# Altium project TOUCH.PrjPcb
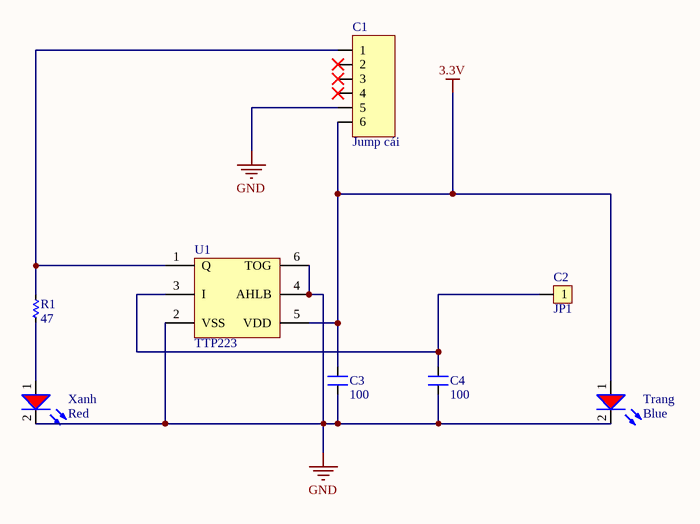
[diagram p0: TOUCH1.SchDoc]
4 sheets, 8 parts. Net scope: global (net labels, ports and power ports of the same name join across sheets).
Board file: PCB1.PcbDoc
Sheets:
  POWER.SchDoc
  TOUCH1.SchDoc
  TOUCH2.SchDoc
  TOUCH3.SchDoc

## Sheet POWER.SchDoc
size A4

## Sheet TOUCH1.SchDoc
size A4

### Parts
C1  Jump cái  [JP6-C1T]
C2  JP1  [JP1-D1T]
C3  100  [SM-0805]
C4  100  [SM-0805]
R1  47  [RES-SMD-0805]
Trang  value Blue  [LED-RED-0805]  (hidden comment: LED-Red)
U1  TTP223  [SOT23-6]
Xanh  value Red  [LED-RED-0805]  (hidden comment: LED-Red)

### Nets
3.3V: C1.6 C3.1 Trang.1(A) U1.5(VDD)
GND: C1.5 C3.2 C4.2 Trang.2(K) U1.2(VSS) U1.4(AHLB) U1.6(TOG) Xanh.2(K)
NetC1_1: C1.1 R1.1 U1.1(Q)
NetC2_1: C2.1 C4.1 U1.3(I)
NetR1_2: R1.2 Xanh.1(A)

Not connected (* = marked no-connect by the designer): C1 2* 3* 4*

### Library data of the parts
C1 = JP6: WR-PHD 2.54 mm Angled Socket Header; Manufacturer: W¨¹rth Elektronik eiSos GmbH; partNo: 613006143121; ComponentLink1 Description: Manufacturer; ComponentLink2 Description: Datasheet; NoPins: 06; Created Date: 29 March 2013; ComponentLink1URL: http://www.we-online.com; ComponentLink2URL: http://katalog.we-online.de/em/datasheet/6130xx143121.pdf; Created by: Karrer Zheng
C2 = JP1: WR-PHD 2.54 mm Angled Socket Header; Manufacturer: W¨¹rth Elektronik eiSos GmbH; partNo: 613002143121; ComponentLink1 Description: Manufacturer; ComponentLink2 Description: Datasheet; NoPins: 02; Created Date: 29 March 2013; ComponentLink1URL: http://www.we-online.com; ComponentLink2URL: http://katalog.we-online.de/em/datasheet/6130xx143121.pdf; Created by: Karrer Zheng
C3 C4 = CM: Cap SMD; Value: 103
R1 = Res-SMD: Resistor; Manufacturer: Generic Components; Class: Passive; Published: 08/06/2000; Publisher: Altium Hobart Technology Centre
Trang Xanh = Led-Red: LED Red 2mA 1.8V 0805; ComponentLink1Description: Datasheet; ComponentLink1URL: D:\Dropbox\Datasheets\Opto and Illumination\LEDs\SMD LED.pdf; Unit Price: 0.0476
U1 = TTP223: Half-Bridge Driver

## Sheet TOUCH2.SchDoc
size A4

## Sheet TOUCH3.SchDoc
size A4